# Altium schematic sheet power-v3v8.SchDoc: Power 3.8V
size Letter; CheckedBy: J. Brinton; CompanyName: Signal Laboratories, Inc.; DrawnBy: J. Brinton; Engineer: J. Brinton; Address1: 3479 Edison Way; Address2: Menlo Park CA 94025; Address3: +1 (877) 778-8435; Address4: siglabs.com; Revision: 3; SheetNumber: 43; SheetTotal: 53
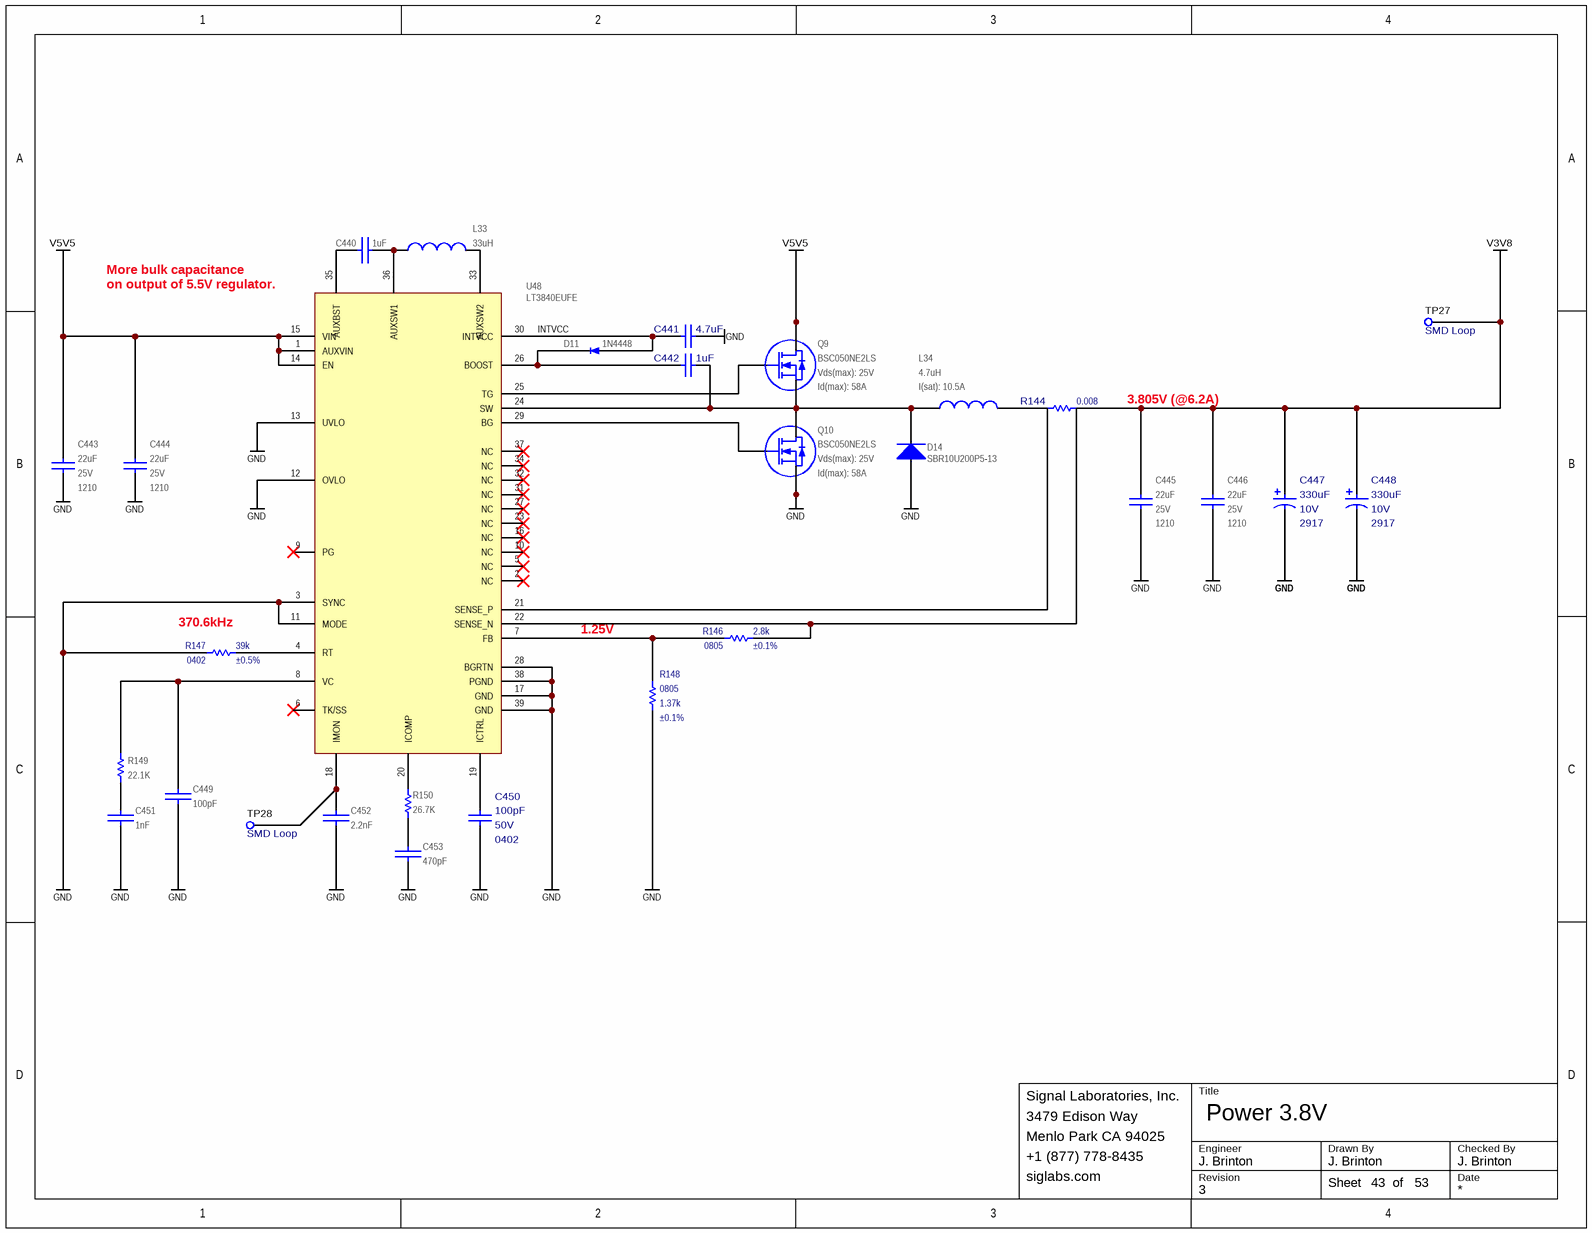
[diagram p0: power-v3v8.SchDoc]

## Parts
C440  value 1uF  [CAPC100X50X55L25N]  (hidden comment: GRM155R61A105KE15)
C441  value 4.7uF  [CAPC160X80X90L20N]  (hidden comment: CL10A475KA8NQNC)
C442  value 1uF  [CAPC100X50X55L25N]  (hidden comment: GRM155R61A105KE15)
C443  value 22uF  Voltage: 25V  Package: 1210  [CAPC320X250X270L50N]  (hidden comment: GRM32ER71E226KE15)
C444  value 22uF  Voltage: 25V  Package: 1210  [CAPC320X250X270L50N]  (hidden comment: GRM32ER71E226KE15)
C445  value 22uF  Voltage: 25V  Package: 1210  [CAPC320X250X270L50N]  (hidden comment: GRM32ER71E226KE15)
C446  value 22uF  Voltage: 25V  Package: 1210  [CAPC320X250X270L50N]  (hidden comment: GRM32ER71E226KE15)
C447  value 330uF  Package: 2917  Voltage: 10V  [CAPPM730X435X310L135X240N]  (hidden comment: TPSE337K010R0050)
C448  value 330uF  Package: 2917  Voltage: 10V  [CAPPM730X435X310L135X240N]  (hidden comment: TPSE337K010R0050)
C449  value 100pF  [CAPC100X50X55L25N]  (hidden comment: GRM1555C1H101JA01)
C450  value 100pF  Package: 0402  Voltage: 50V  [CAPC100X50X55L25N]  (hidden comment: VJ0402A101KXA)
C451  value 1nF  [CAPC100X50X55L25N]  (hidden comment: GRM1555C1H102JA01)
C452  value 2.2nF  [CAPC100X50X55L25N]  (hidden comment: C0402C222J3GACTU)
C453  value 470pF  [CAPC100X50X55L25N]  (hidden comment: GRM155R71H471JA01)
D11  Alternative P/N: 1N4448  [SOD323]  (hidden comment: 1N4448HWS-7-F)
D14  SBR10U200P5-13  [DIODES_POWERDI5]
L33  value 33uH  [ME3220]  (hidden comment: ME3220-333KL)
L34  value 4.7uH  I(sat): 10.5A  [XAL6060]  (hidden comment: XAL6060-472ME)
Q9  BSC050NE2LS  Vds(max): 25V  Id(max): 58A  [TDSON-8]
Q10  BSC050NE2LS  Vds(max): 25V  Id(max): 58A  [TDSON-8]
R144  value 0.008  [KRL3216T4]  (hidden comment: KRL3216T4A-M-R008-F)
R146  value 2.8k  Tolerance: ±0.1%  Package: 0805  [RESC2012X70N]  (hidden comment: RT0805BRD072K8L)
R147  value 39k  Tolerance: ±0.5%  Package: 0402  [RESC1005X40N]  (hidden comment: RR0510P-393-D)
R148  value 1.37k  Tolerance: ±0.1%  Package: 0805  [RESC2012X70N]  (hidden comment: RT0805BRD071K37L)
R149  value 22.1K  [RESC1005X40N]  (hidden comment: ERJ-2RKF2212X)
R150  value 26.7K  [RESC1005X40N]  (hidden comment: ERJ-2RKF2672X)
TP27  Notes: SMD Loop  [5015]  (hidden comment: 5015)
TP28  Notes: SMD Loop  [5015]  (hidden comment: 5015)
U48  LT3840EUFE  [QFN39P40_600X400X80L40X20T465X265N]

## Nets
GND: C441.2 C443.1 C444.1 C445.1 C446.1 C447.2 C448.2 C449.1 C450.2 C451.2 C452.2 C453.1 D14.A Q10.1(S) Q10.2(S) Q10.3(S) R147.2 R148.1 U48.3(SYNC) U48.11(MODE) U48.12(OVLO) U48.13(UVLO) U48.17(GND) U48.28(BGRTN) U48.38(PGND) U48.39(GND)
V3V8: C445.2 C446.2 C447.1 C448.1 R144.1 TP27.1
V5V5: C443.2 C444.2 Q9.5(D) Q9.6(D) Q9.7(D) Q9.8(D) Q9.9(D) U48.1(AUXVIN) U48.14(EN) U48.15(VIN)
INTVCC: C441.1 D11.A U48.30(INTVCC)
NetC440_1: C440.1 L33.1 U48.36(AUXSW1)
NetC440_2: C440.2 U48.35(AUXBST)
NetC442_1: C442.1 D11.K U48.26(BOOST)
NetC442_2: C442.2 D14.K L34.1 Q9.1(S) Q9.2(S) Q9.3(S) Q10.5(D) Q10.6(D) Q10.7(D) Q10.8(D) Q10.9(D) U48.24(SW)
NetC449_2: C449.2 R149.2 U48.8(VC)
NetC450_1: C450.1 U48.19(ICTRL)
NetC451_1: C451.1 R149.1
NetC452_1: C452.1 TP28.1 U48.18(IMON)
NetC453_2: C453.2 R150.2
NetL33_2: L33.2 U48.33(AUXSW2)
NetL34_2: L34.2 R144.2
NetQ9_4: Q9.4(G) U48.25(TG)
NetQ10_4: Q10.4(G) U48.29(BG)
NetR144_3: R144.3 R146.1 U48.22(SENSE_N)
NetR144_4: R144.4 U48.21(SENSE_P)
NetR146_2: R146.2 R148.2 U48.7(FB)
NetR147_1: R147.1 U48.4(RT)
NetR150_1: R150.1 U48.20(ICOMP)

Not connected (* = marked no-connect by the designer): U48 2(NC)* 5(NC)* 6(TK/SS)* 9(PG)* 10(NC)* 16(NC)* 23(NC)* 27(NC)* 31(NC)* 32(NC)* 34(NC)* 37(NC)*

## Notes on the sheet
- More bulk capacitance
- (near U48) on output of 5.5V regulator.
- (near R144) 3.805V (@6.2A)
- (near R147) 370.6kHz
- 1.25V
- Title
- Engineer
- Revision
- Drawn By
- Checked By
- Date
- Sheet
- of

## Library data of the parts
C440 = CAP: Ceramic Capacitor 1uF ±10% 10V X5R 0402; Manufacturer: Murata; Tr: -55:125; Manufacturer P/N: GRM155R61A105KE15; Package: 0402; Tolerance: ±10%; Voltage: 10V
C441 = TMK212B7475KG: Ceramic Capacitor 4.7uF ±10% 25V X5R 0603; Manufacturer: Samsung; Tr: -55:85; Manufacturer P/N: CL10A475KA8NQNC; Tolerance: ±10%; Package: 0603; Voltage: 25V
C442 = UMK212B7105KG: Ceramic Capacitor 1uF ±10% 10V X5R 0402; Manufacturer: Murata; Voltage: 50V; Manufacturer P/N: GRM155R61A105KE15; Tolerance: ±10%; Tr: *; Package: 0402
C443-C446 = CAP: Ceramic Capacitor 22uF ±10% 25V X7R 1210; Manufacturer: Murata; Tr: -55:125; Manufacturer P/N: GRM32ER71E226KE15; Tolerance: ±10%
C447 C448 = CAP_POL: Tantalum Capacitor 330uF ±10% 10V 2917; Manufacturer: AVX; Tr: -55:125; Manufacturer P/N: TPSE337K010R0050; Tolerance: ±10%
C449 = CAP: Ceramic Capacitor 100pF ±5% 50V NP0 0402; Manufacturer: Murata; Tr: -55:125; Manufacturer P/N: GRM1555C1H101JA01; Voltage: 50V; Package: 0402; Tolerance: ±5%
C450 = VJ0402A101KXA: Ceramic Capacitor 100pF ±10% 50V C0G 0402; Manufacturer: Vishay; Tr: -55:150; Manufacturer P/N: VJ0402A101KXA; Tolerance: ±10%
C451 = CAP: Ceramic Capacitor 1nF ±5% 50V NP0 0402; Manufacturer: Murata; Tr: -55:125; Manufacturer P/N: GRM1555C1H102JA01; Voltage: 50V; Package: 0402; Tolerance: ±5%
C452 = CAP: Ceramic Capacitor 2.2nF ±5% 25V NP0 0402; Manufacturer: Kemet; Tr: -55:125; Manufacturer P/N: C0402C222J3GACTU; Package: 0402; Tolerance: ±5%; Voltage: 25V
C453 = CAP: Ceramic Capacitor 470pF ±5% 50V X7R 0402; Manufacturer: Murata; Tr: -55:125; Manufacturer P/N: GRM155R71H471JA01; Voltage: 50V; Package: 0402; Tolerance: ±5%
D11 = 1N4448HWS-7-F: Schottky Diode 80V 250mA SOD323; Manufacturer: Diodes Inc; Manufacturer P/N: 1N4448HWS-7-F; Package: SOD323
D14 = PDS5100H: Schottky Diode 200V 10A SMD; Manufacturer: Diodes Inc; Manufacturer P/N: SBR10U200P5-13; Current: 10A; Reverse Voltage (max): 200V; Package: PowerDi-5
L33 = COIL: Inductor 33uH ±10% 500mA SMD; Manufacturer: Coilcraft; Tr: -40:85; Manufacturer P/N: ME3220-333KL; I(sat): 500mA; Package: *; Tolerance: ±10%
L34 = COIL: Inductor 4.7uH,10.5A(sat), SMD; Manufacturer: Coilcraft; Manufacturer P/N: XAL6060-472ME
Q9 Q10 = BSC190N15NS3: MOSFET N-Channel Enhancement Mode; Manufacturer: Infineon; Rds(on): 5mOhm; Manufacturer P/N: BSC050NE2LS
R144 = KRL3216T4A-M-R009-F: Current Sense Resistor 8 mOhms +/-1% SMD 4-Terminal; Manufacturer: Susumu; Tolerance: ±1%; Tr: -55:+155; Manufacturer P/N: KRL3216T4A-M-R008-F
R146 = RES: Thin Film Resistor 2.8k +/-0.1% SMD 0805; Manufacturer: Yageo; Tr: -55:155; Tcr: *; Manufacturer P/N: RT0805BRD072K8L; Alternatives: *; Voltage: *; Power: *
R147 = RES: Thin Film Resistor 39k +/-0.5% SMD 0402; Manufacturer: Susumu; Tr: -55:155; Tcr: *; Manufacturer P/N: RR0510P-393-D; Alternatives: *; Voltage: *; Power: *
R148 = RES: Thin Film Resistor 1.37k +/-0.1% SMD 0805; Manufacturer: Yageo; Tr: -55:155; Tcr: *; Manufacturer P/N: RT0805BRD071K37L; Alternatives: *; Voltage: *; Power: *
R149 = RES 0402: Thick Film Resistor 22.1k ±1% 0402; Manufacturer: Panasonic; Tr: -55:155; Package: 0402; Manufacturer P/N: ERJ-2RKF2212X; Tolerance: ±1%
R150 = RES 0402: Thick Film Resistor 26.7k ±1% 0402; Manufacturer: Panasonic; Tr: -55:155; Package: 0402; Manufacturer P/N: ERJ-2RKF2672X; Tolerance: ±1%
TP27 TP28 = TEST_POINT_SMD_50: Test Point SMD; Manufacturer: Keystone; Manufacturer P/N: 5015
U48 = LT3840EUFE: Synchronous Regulator Controller; Manufacturer: Linear Technology; Alternative P/N: LT3840IUFE; Manufacturer P/N: LT3840EUFE